# EAGLE design ADAPT_MAXREFDES117 (EAGLE 9.5.2)
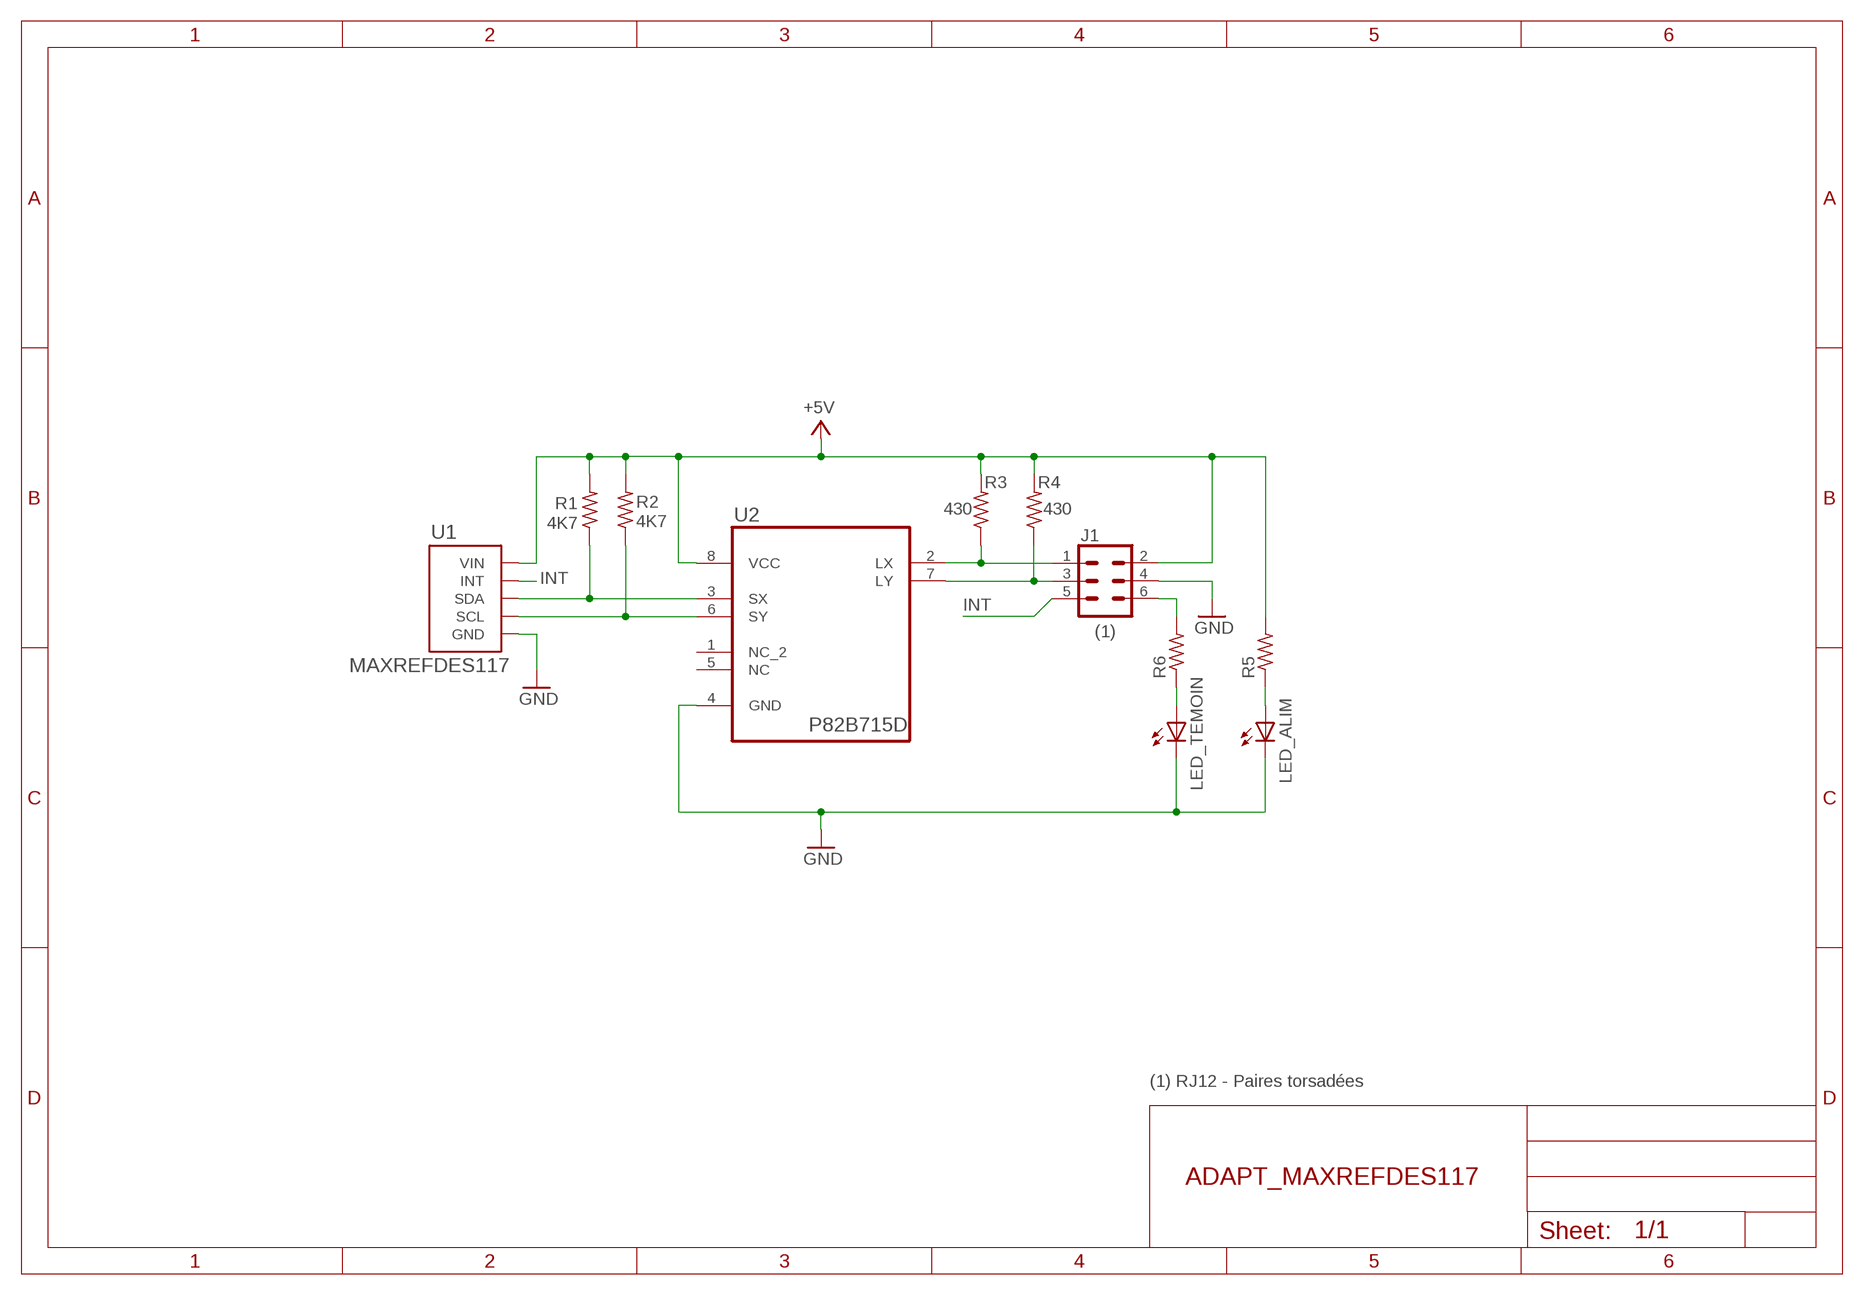
[diagram p0: schematic, sheet 1]

## Parts
J1  CONN_03X2NO_SILK  [2X3-NS]
LED_ALIM  LEDFAB1206  [LED1206FAB]
LED_TEMOIN  LEDFAB1206  [LED1206FAB]
R1  4K7  RES-US1206FAB  [R1206FAB]
R2  4K7  RES-US1206FAB  [R1206FAB]
R3  430  RES-US1206FAB  [R1206FAB]
R4  430  RES-US1206FAB  [R1206FAB]
R5  RES-US1206FAB  [R1206FAB]
R6  RES-US1206FAB  [R1206FAB]
U1  MAXREFDES117  [MAXREFDES117]
U2  P82B715D  [SOIC127P600X175-8N]

## Nets
+5V: J1.2 R1.2 R2.2 R3.2 R4.2 R5.2 U1.VIN U2.8(VCC)
GND: J1.4 LED_ALIM.2(C) LED_TEMOIN.2(C) U1.GND U2.4(GND)
INT: J1.5 U1.INT$1(INT) U1.INT$2(INT)
N$1: R1.1 U1.SDA$1(SDA) U1.SDA$2(SDA) U2.3(SX)
N$2: R2.1 U1.SCL$1(SCL) U1.SCL$2(SCL) U2.6(SY)
N$3: J1.1 R3.1 U2.2(LX)
N$4: LED_TEMOIN.1(A) R6.1
N$5: LED_ALIM.1(A) R5.1
N$6: J1.3 R4.1 U2.7(LY)
N$7: J1.6 R6.2
Unconnected: U2.1(NC_2) U2.5(NC)

## Notes on the sheet
- (1)
- (1) RJ12 - Paires torsadées

## Library data of the parts
J1 = fab:CONN_03X2: Multi connection point. Often used as Generic Header-pin footprint for 0.1 inch spaced/style header connections You can populate with any combo of single row headers, but if you'd like an exact match, check these: Header - 2x3 (Male, 0.1") <https://www.sparkfun.com/products/12807> (PRT-12807) Header - 2x3 (Female, 0.1") <https://www.sparkfun.com/products/13010> (PRT-13010) 2x3 Pin Shrouded Header <https://www.sparkfun.com/products/10877> (PRT-10877) On any of the 0.1 inch spaced packages, you can populate with these: Break Away Headers - Straight <https://www.sparkfun.com/products/116> (PRT-00116) Break Away Male Headers - Right Angle <https://www.sparkfun.com/products/553> (PRT-00553) Female Headers <https://www.sparkfun.com/products/115> (PRT-00115) Break Away Headers - Machine Pin <https://www.sparkfun.com/products/117> (PRT-00117) Break Away Female Headers - Swiss Machine Pin <https://www.sparkfun.com/products/743> (PRT-00743) Special note: the shrouded connector mates well with our 3x2 ribbon cables: Ribbon Crimp Connector - 6-pin (2x3, Female) <https://www.sparkfun.com/products/10651> (PRT-10651) Ribbon Cable - 6 wire (15ft) <https://www.sparkfun.com/products/10646> (PRT-10646)
LED_ALIM LED_TEMOIN = fab:LED: LED
R1-R6 = fab:RES-US: Resistor (US Symbol) Variants with postfix FAB are widened to allow the routing of internal traces
U1 = OXYMETRE_COVID19:MAXREFDES117
U2 = OXYMETRE_COVID19:P82B715D: I2C BUS EXTENDER; AVAILABILITY: Unavailable; DESCRIPTION: Buffer, ReDriver 1 Channel 8-SOIC; MF: Texas Instruments; MP: P82B715D; PACKAGE: SOIC-8 Texas Instruments; PRICE: None

## Board
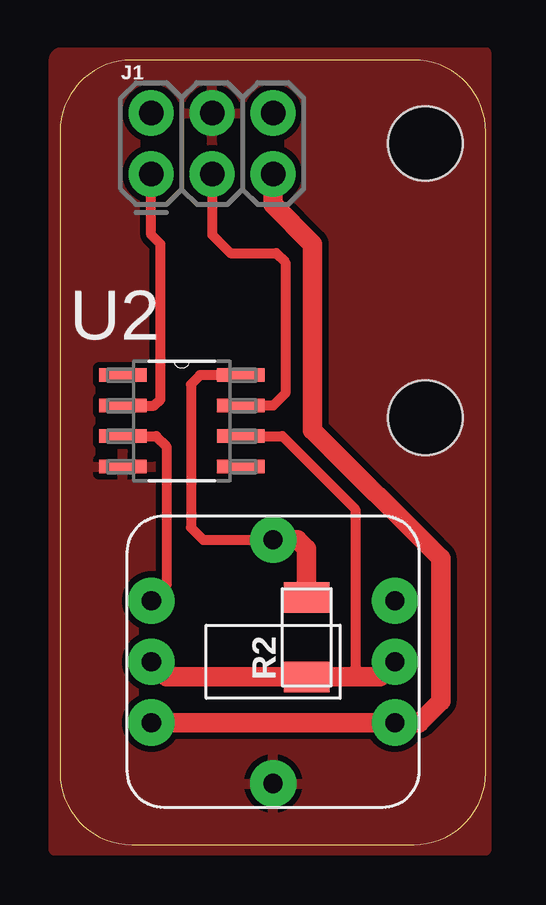
[diagram p1: board, top side]
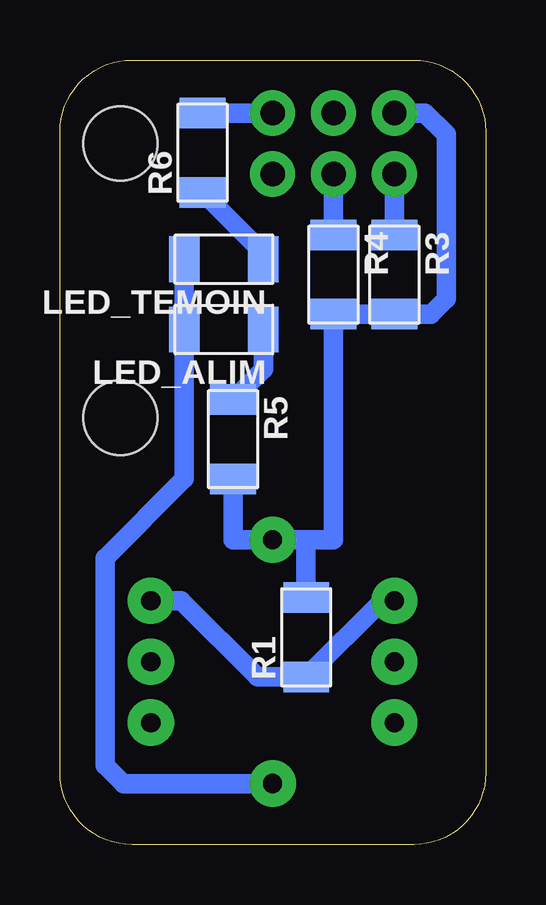
[diagram p2: board, bottom side, seen from below]

Size 17.76 x 32.69 mm. Coordinates in mm from the lower left corner, seen from the top.
Outline: 0,29.69 0,3 arc90 3,0 14.76,0 arc90 17.76,3 17.76,29.69 arc90 14.76,32.69 3,32.69 arc90 0,29.69
Copper layers (1*16): Top 0.035mm / dielectric 1.5mm / Bottom 0.035mm
Design rules "OthermillDRC_1_100_v2": minimum track width 8mil, minimum drill 0.8mm, track to track 0.256540625mm, track to pad 0.256540625mm, pad to pad 0.256540625mm, via to via 0.256540625mm, smd to smd 0mil, copper to edge 0mil, drill to drill 1mil, minimum pad ring 10mil, minimum via ring 10mil, stop-mask expansion 1mil, vias tented up to drill 30mil, thermal gap 10mil
Holes 3.1 mm at 15.24,17.78 15.24,29.21

### Footprints (pad centres in the part's own frame; a part is rotated, then mirrored left to right if it is on the bottom)
2X3-NS = drill 1.016 pad 1.88: 1 -2.54,-1.27; 2 -2.54,1.27; 3 0,-1.27; 4 0,1.27; 5 2.54,-1.27; 6 2.54,1.27
LED1206FAB = smd 1.27 x 1.905: 1 -1.651,0; 2 1.651,0
R1206FAB = smd 1.27 x 1.905: 1 -1.651,0; 2 1.651,0
MAXREFDES117 = drill 0.8 pad 1.93: GND -5.08,0; INT$1 -2.54,5.08; INT$2 -2.54,-5.08; SCL$1 0,5.08; SCL$2 0,-5.08; SDA$1 2.54,5.08; SDA$2 2.54,-5.08; VIN 5.08,0
SOIC127P600X175-8N = smd 1.981 x 0.559: 1 -2.464,1.905; 2 -2.464,0.635; 3 -2.464,-0.635; 4 -2.464,-1.905; 5 2.464,-1.905; 6 2.464,-0.635; 7 2.464,0.635; 8 2.464,1.905

### Placement (x,y rotation side)
J1  6.35,29.21 0 top
LED_ALIM  10.92,21.46 180 bottom
LED_TEMOIN  10.92,24.38 180 bottom
R1  7.49,8.64 90 bottom
R2  10.29,8.64 90 top
R3  3.81,23.75 270 bottom
R4  6.35,23.75 270 bottom
R5  10.54,16.89 270 bottom
R6  11.81,28.83 90 bottom
U1  8.89,7.62 90 top
U2  5.08,17.65 0 top

### Tracks (layer width: path | path; a pad name or v marks a point on that pad's centre or on a via)
+5V
  Top 0.406: U2.8 5.84,19.56 5.46,19.18 5.46,13.21 5.97,12.7 U1.VIN
  Top 0.813: R2.2 10.29,12.32 9.91,12.7 U1.VIN
  Bottom 0.813: R5.2 10.54,12.7 U1.VIN 7.49,12.7 | R1.2 7.49,12.7 | 7.49,12.7 6.35,12.7 R4.2 R3.2 2.29,22.1 1.65,22.73 1.65,29.59 2.54,30.48 J1.2
GND
  Bottom 0.813: LED_TEMOIN.2 LED_ALIM.2 12.57,15.24 15.88,11.94 15.88,3.3 15.11,2.54 U1.GND
  pour Top: -0.25,-0.25 -0.25,32.69 arc-90 0.08,33.02 17.78,33.02 17.78,-0.25
INT
  Top 0.813: U1.INT$1 U1.INT$2 14.99,5.08 15.88,5.97 15.88,11.94 10.54,17.27 10.54,25.02 8.89,26.67 J1.5
N$1
  Top 0.406: U1.SDA$1 4.45,10.79 4.45,16.59 4.01,17.02 U2.3
  Bottom 0.813: U1.SDA$1 4.32,10.16 R1.1 9.53,6.99 12.7,10.16 U1.SDA$2
N$2
  Top 0.406: U2.6 9.27,17.02 12.32,13.97 12.32,7.37 12.7,6.99
  Top 0.813: U1.SCL$1 4.45,6.99 R2.1 12.7,6.99 13.34,6.99 U1.SCL$2
N$3
  Top 0.406: U2.2 3.94,18.29 4.19,18.54 4.19,25.02 R3.1 J1.1
  Bottom 0.813: R3.1 J1.1
N$4
  Bottom 0.813: R6.1 9.27,24.64 LED_TEMOIN.1
N$5
  Bottom 0.813: LED_ALIM.1 9.27,19.81 R5.1
N$6
  Top 0.406: J1.3 R4.1 7.11,24.64 9.02,24.64 9.4,24.26 9.4,18.8 8.89,18.29 U2.7
  Bottom 0.813: R4.1 J1.3
N$7
  Bottom 0.813: R6.2 J1.6